# Altium project PROC051C_AWR1843BOOST_RevC.PrjPcb (part 5 of 7)

## Sheet PROC051C_HD Connector.SchDoc: HD Connector
size 431 x 279 mm; Date: Not shown in title block; ApprovedBy: Not shown in title block; CheckedBy: Not shown in title block; Author: Not shown in title block; CompanyName: Not shown in title block; Engineer: Not shown in title block; Organization: Not shown in title block; Address1: Not shown in title block; Address2: Not shown in title block; Address3: Not shown in title block; Address4: Not shown in title block; DocumentNumber: 10; Revision: Use project parameter SCH_Rev; SheetNumber: 10; SheetTotal: 16; PageSetup: Record=PageOptions|CenterHorizontal=True|CenterVertical=True|PrintScale=1.00|XCorrection=1.00|YCorrection=1.00|PrintKind=0|BorderSize=5000000|LeftOffset=0|BottomOffset=0|Orientation=2|PaperLength=1000|PaperWidth=1000|Scale=100|PaperSource=15|PrintQuality=600|MediaType=1|DitherType=10|PrintScaleMode=1|PaperKind=Letter; CurrentTime: Not shown in title block; CurrentDate: Not shown in title block; Time: Not shown in title block; DocumentFullPathAndName: Not shown in title block; DocumentName: Not shown in title block; ModifiedDate: Not shown in title block; ImagePath: Not shown in title block
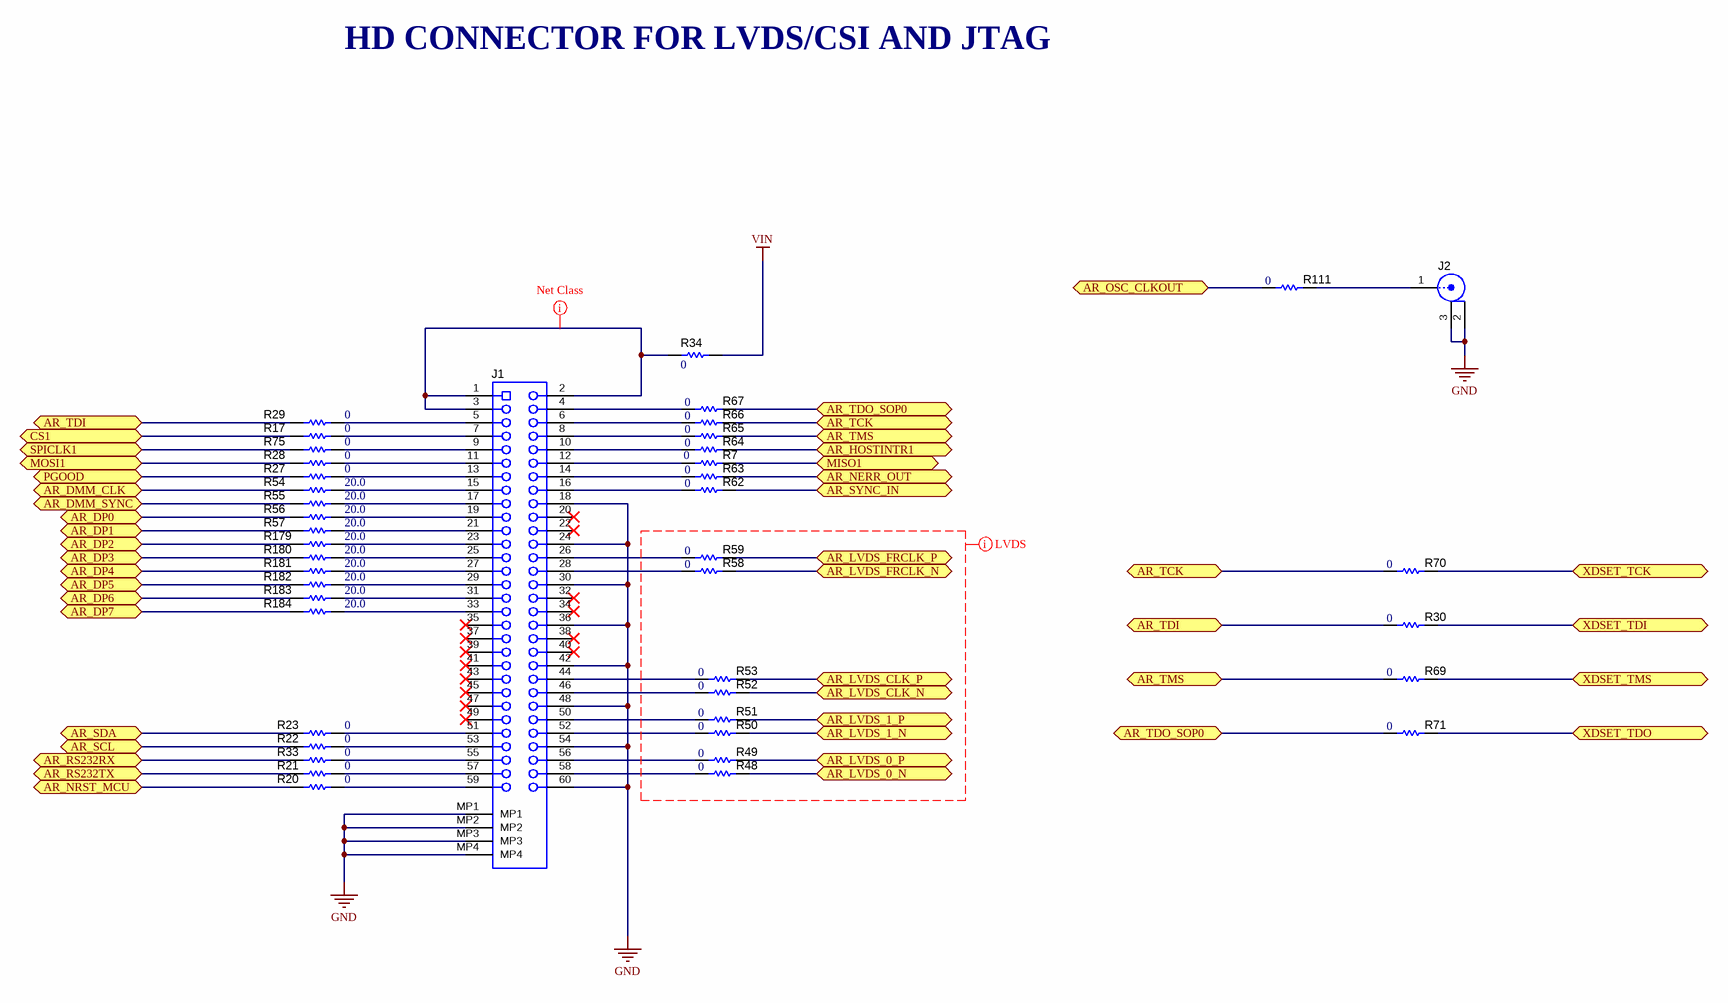
[diagram p9: PROC051C_HD Connector.SchDoc]

### Parts
J1  QSH-030-01-L-D-A  [Samtec_QSH-030-01-X-D-A]  (value not drawn)
J2  128-0711-201  [Johnson_128-0711-201]  (value not drawn)
R7  ValueDisplayed: 0  [0201_Silk]  (hidden comment: CRCW02010000Z0ED)
R17  ValueDisplayed: 0  [0201_Silk]  (hidden comment: CRCW02010000Z0ED)
R20  ValueDisplayed: 0  [0201_Silk]  (hidden comment: CRCW02010000Z0ED)
R21  ValueDisplayed: 0  [0201_Silk]  (hidden comment: CRCW02010000Z0ED)
R22  ValueDisplayed: 0  [0201_Silk]  (hidden comment: CRCW02010000Z0ED)
R23  ValueDisplayed: 0  [0201_Silk]  (hidden comment: CRCW02010000Z0ED)
R27  ValueDisplayed: 0  [0201_Silk]  (hidden comment: CRCW02010000Z0ED)
R28  ValueDisplayed: 0  [0201_Silk]  (hidden comment: CRCW02010000Z0ED)
R29  ValueDisplayed: 0  [0201_Silk]  (hidden comment: CRCW02010000Z0ED)
R30  ValueDisplayed: 0  [0201_Silk]  (hidden comment: CRCW02010000Z0ED)
R33  ValueDisplayed: 0  [0201_Silk]  (hidden comment: CRCW02010000Z0ED)
R34  ValueDisplayed: 0  [2010]  (hidden comment: CRCW20100000Z0EF)
R48  ValueDisplayed: 0  [0201_Silk]  (hidden comment: CRCW02010000Z0ED)
R49  ValueDisplayed: 0  [0201_Silk]  (hidden comment: CRCW02010000Z0ED)
R50  ValueDisplayed: 0  [0201_Silk]  (hidden comment: CRCW02010000Z0ED)
R51  ValueDisplayed: 0  [0201_Silk]  (hidden comment: CRCW02010000Z0ED)
R52  ValueDisplayed: 0  [0201_Silk]  (hidden comment: CRCW02010000Z0ED)
R53  ValueDisplayed: 0  [0201_Silk]  (hidden comment: CRCW02010000Z0ED)
R54  ValueDisplayed: 20.0  [0201_033]  (hidden comment: CRCW020120R0FNED)
R55  ValueDisplayed: 20.0  [0201_033]  (hidden comment: CRCW020120R0FNED)
R56  ValueDisplayed: 20.0  [0201_033]  (hidden comment: CRCW020120R0FNED)
R57  ValueDisplayed: 20.0  [0201_033]  (hidden comment: CRCW020120R0FNED)
R58  ValueDisplayed: 0  [0201_Silk]  (hidden comment: CRCW02010000Z0ED)
R59  ValueDisplayed: 0  [0201_Silk]  (hidden comment: CRCW02010000Z0ED)
R62  ValueDisplayed: 0  [0201_Silk]  (hidden comment: CRCW02010000Z0ED)
R63  ValueDisplayed: 0  [0201_Silk]  (hidden comment: CRCW02010000Z0ED)
R64  ValueDisplayed: 0  [0201_Silk]  (hidden comment: CRCW02010000Z0ED)
R65  ValueDisplayed: 0  [0201_Silk]  (hidden comment: CRCW02010000Z0ED)
R66  ValueDisplayed: 0  [0201_Silk]  (hidden comment: CRCW02010000Z0ED)
R67  ValueDisplayed: 0  [0201_Silk]  (hidden comment: CRCW02010000Z0ED)
R69  ValueDisplayed: 0  [0201_Silk]  (hidden comment: CRCW02010000Z0ED)
R70  ValueDisplayed: 0  [0201_Silk]  (hidden comment: CRCW02010000Z0ED)
R71  ValueDisplayed: 0  [0201_Silk]  (hidden comment: CRCW02010000Z0ED)
R75  ValueDisplayed: 0  [0201_Silk]  (hidden comment: CRCW02010000Z0ED)
R111  ValueDisplayed: 0  [0201_Silk]  (hidden comment: CRCW02010000Z0ED)
R179  ValueDisplayed: 20.0  [0201_033]  (hidden comment: CRCW020120R0FNED)
R180  ValueDisplayed: 20.0  [0201_033]  (hidden comment: CRCW020120R0FNED)
R181  ValueDisplayed: 20.0  [0201_033]  (hidden comment: CRCW020120R0FNED)
R182  ValueDisplayed: 20.0  [0201_033]  (hidden comment: CRCW020120R0FNED)
R183  ValueDisplayed: 20.0  [0201_033]  (hidden comment: CRCW020120R0FNED)
R184  ValueDisplayed: 20.0  [0201_033]  (hidden comment: CRCW020120R0FNED)

### Ports
AR_DMM_CLK, AR_DMM_SYNC, AR_DP0, AR_DP1, AR_DP2, AR_DP3, AR_DP4, AR_DP5, AR_DP6, AR_DP7, AR_HOSTINTR1, AR_LVDS_0_N, AR_LVDS_0_P, AR_LVDS_1_N, AR_LVDS_1_P, AR_LVDS_CLK_N, AR_LVDS_CLK_P, AR_LVDS_FRCLK_N, AR_LVDS_FRCLK_P, AR_NERR_OUT, AR_NRST_MCU, AR_OSC_CLKOUT, AR_RS232RX, AR_RS232TX, AR_SCL, AR_SDA, AR_SYNC_IN, AR_TCK, AR_TDI, AR_TDO_SOP0, AR_TMS, CS1, MISO1, MOSI1, PGOOD, SPICLK1, XDSET_TCK, XDSET_TDI, XDSET_TDO, XDSET_TMS

### Nets
GND: J1.18 J1.24 J1.30 J1.36 J1.42 J1.48 J1.54 J1.60 J1.MP1 J1.MP2 J1.MP3 J1.MP4 J2.2 J2.3
VIN: R34.2
AR_DMM_CLK: R54.1 ; port AR_DMM_CLK
AR_DMM_SYNC: R55.1 ; port AR_DMM_SYNC
AR_DP0: R56.1 ; port AR_DP0
AR_DP1: R57.1 ; port AR_DP1
AR_DP2: R179.1 ; port AR_DP2
AR_DP3: R180.1 ; port AR_DP3
AR_DP4: R181.1 ; port AR_DP4
AR_DP5: R182.1 ; port AR_DP5
AR_DP6: R183.1 ; port AR_DP6
AR_DP7: R184.1 ; port AR_DP7
AR_HOSTINTR1: R64.2 ; port AR_HOSTINTR1
AR_LVDS_0_N: R48.2 ; port AR_LVDS_0_N
AR_LVDS_0_P: R49.2 ; port AR_LVDS_0_P
AR_LVDS_1_N: R50.2 ; port AR_LVDS_1_N
AR_LVDS_1_P: R51.2 ; port AR_LVDS_1_P
AR_LVDS_CLK_N: R52.2 ; port AR_LVDS_CLK_N
AR_LVDS_CLK_P: R53.2 ; port AR_LVDS_CLK_P
AR_LVDS_FRCLK_N: R58.2 ; port AR_LVDS_FRCLK_N
AR_LVDS_FRCLK_P: R59.2 ; port AR_LVDS_FRCLK_P
AR_NERR_OUT: R63.2 ; port AR_NERR_OUT
AR_NRST_MCU: R20.1 ; port AR_NRST_MCU
AR_OSC_CLKOUT: R111.1 ; port AR_OSC_CLKOUT
AR_RS232RX: R33.1 ; port AR_RS232RX
AR_RS232TX: R21.1 ; port AR_RS232TX
AR_SCL: R22.1 ; port AR_SCL
AR_SDA: R23.1 ; port AR_SDA
AR_SYNC_IN: R62.2 ; port AR_SYNC_IN
AR_TCK: R66.2 R70.1 ; port AR_TCK
AR_TDI: R29.1 R30.1 ; port AR_TDI
AR_TDO_SOP0: R67.2 R71.1 ; port AR_TDO_SOP0
AR_TMS: R65.2 R69.1 ; port AR_TMS
CS1: R17.1 ; port CS1
MISO1: R7.2 ; port MISO1
MOSI1: R28.1 ; port MOSI1
PGOOD: R27.1 ; port PGOOD
SPICLK1: R75.1 ; port SPICLK1
XDSET_TCK: R70.2 ; port XDSET_TCK
XDSET_TDI: R30.2 ; port XDSET_TDI
XDSET_TDO: R71.2 ; port XDSET_TDO
XDSET_TMS: R69.2 ; port XDSET_TMS
NetJ1_1: J1.1 J1.2 J1.3 R34.1
NetJ1_4: J1.4 R67.1
NetJ1_5: J1.5 R29.2
NetJ1_6: J1.6 R66.1
NetJ1_7: J1.7 R17.2
NetJ1_8: J1.8 R65.1
NetJ1_9: J1.9 R75.2
NetJ1_10: J1.10 R64.1
NetJ1_11: J1.11 R28.2
NetJ1_12: J1.12 R7.1
NetJ1_13: J1.13 R27.2
NetJ1_14: J1.14 R63.1
NetJ1_15: J1.15 R54.2
NetJ1_16: J1.16 R62.1
NetJ1_17: J1.17 R55.2
NetJ1_19: J1.19 R56.2
NetJ1_21: J1.21 R57.2
NetJ1_23: J1.23 R179.2
NetJ1_25: J1.25 R180.2
NetJ1_26: J1.26 R59.1
NetJ1_27: J1.27 R181.2
NetJ1_28: J1.28 R58.1
NetJ1_29: J1.29 R182.2
NetJ1_31: J1.31 R183.2
NetJ1_33: J1.33 R184.2
NetJ1_44: J1.44 R53.1
NetJ1_46: J1.46 R52.1
NetJ1_50: J1.50 R51.1
NetJ1_51: J1.51 R23.2
NetJ1_52: J1.52 R50.1
NetJ1_53: J1.53 R22.2
NetJ1_55: J1.55 R33.2
NetJ1_56: J1.56 R49.1
NetJ1_57: J1.57 R21.2
NetJ1_58: J1.58 R48.1
NetJ1_59: J1.59 R20.2
NetJ2_1: J2.1 R111.2

Not connected (* = marked no-connect by the designer): J1 20* 22* 32* 34* 35* 37* 38* 39* 40* 41* 43* 45* 47* 49*

### Layout directives
net class Undefined: (no net found under the mark)
net class PWR: NetJ1_1

### Notes on the sheet
- HD CONNECTOR FOR LVDS/CSI AND JTAG
- Drawn By:
- SVN Rev:
- Number:
- TID #:
- Orderable:
- Rev:
- Sheet Title:
- File:
- Project Title:
- Designed for:
- Assembly Variant:
- Mod. Date:
- Sheet:
- Size:
- of
- B
- http://www.ti.com
- Texas Instruments and/or its licensors do not warrant the accuracy or completeness of this specification or any information contained therein. Texas Instruments and/or its licensors do not warrant that this design will meet the specifications, will be suitable for your application or fit for any particular purpose, or will operate in an implementation. Texas Instruments and/or its licensors do not warrant that the design is production worthy. You should completely validate and test your design implementation to confirm the system functionality for your application.
- Engineer:
- Contact:
- © Texas Instruments

### Library data of the parts
J1 = CMP-0075524-1: Receptacle, 0.5 mm, 30x2, Gold, TH; Manufacturer: Samtec; Pitch_mm: 0.5; Gender: Female; Green_REACh: Passed; CT: False; Shrouded: N; RowSpacing_mm: 5.73; Green_Lifecycle: Active; Row_Count: 2; ComponentLink1Description: Datasheet URL; RoHS: Y; Supplier Part Number 3: 1667876; Supplier 1: Digi-Key; Orientation: Vertical; Green_EU RoHS: Passed with Exemption; PackageReference: Receptacle, 0.5 mm, 30x2, TH; Color: Black; PartNumber: QSH-030-01-L-D-A; PinCount: 60; Publisher: Texas Instruments; Supplier Part Number 2: 19M9181; ContactFinish: Gold; Supplier 2: Newark; ComponentLink1URL: http://www.samtec.com/ftppub/cpdf/QSH-XXX-01-X-D-XX-MKT.pdf; LatestRevisionDate: 2017-07-12; CompType: Receptacle; CNHeader: False; MountType: SMT; Supplier Part Number 1: SAM8180-ND; Supplier 3: Farnell; Green_EU RoHS-2: Passed
J2 = CMP-0055788-1: UMC Straight Jack Receptacle, 50 Ohm, Gold, SMT; Manufacturer: Cinch Connectivity; CNHeader: FALSE; Gender: Female; ComponentLink1URL: https://cinchconnectivity.com/OA_MEDIA/catalog/pdf_UMCCatalogcatalog.pdf; Supplier Part Number 2: 99M0460; Publisher: Texas Instruments; Supplier 2: Newark; Supplier Part Number 3: 530-1280711201; Supplier 3: Mouser; RoHS: Y; MountType: SMT; Supplier 1: Digi-Key; PackageReference: UMC Straight Jack Receptacle, SMT; PinCount: 3; CompType: Jack; LatestRevisionDate: 26/05/2017; PartNumber: 128-0711-201; Orientation: Vertical; ComponentLink1Description: Datasheet URL; Supplier Part Number 1: J983CT-ND; ContactFinish: Gold; CT: FALSE
R7 R17 R20-R23 R27-R30 R33 R48-R53 R58 R59 R62-R67 R69-R71 R75 R111 = CMP-0027008-4: as R72 on sheet PROC051C_RST_LEDs; RoHS: E; Value1: 5%; MountType: SMT; Supplier 1: Newark; PackageReference: 0201; Tolerance_%: 5%; Res_ohm: 0; CompType: Resistor; PartNumber: CRCW02010000Z0ED; ComponentLink1Description: Datasheet link; AEC Grade: N/A; Supplier Part Number 1: 72M6743; Technology: Thick Film; ComponentLink1URL: http://www.vishay.com/docs/20052/crcw0201e3.pdf
R34 = CMP-0016044-3: RES, 0, 5%, 0.75 W, AEC-Q200 Grade 0, 2010; Manufacturer: Vishay-Dale; Power_W: 750mW; TempCo: ppm/C; Value_Code: 0000; Value: 0; EIA_Code: E24; SizeX_mm: 5; SizeY_mm: 2.5; SizeZ_mm: 1.66; Value2: 0.75W; SizeArea_mm2: 12.5; AEC Qualified: Y; AEC Category: Q200; RoHS: E; Value1: 5%; MountType: SMT; Supplier 1: Digi-Key; PackageReference: 2010; Tolerance_%: 5%; Res_ohm: 0; CompType: Resistor; PartNumber: CRCW20100000Z0EF; ComponentLink1Description: Datasheet link; AEC Grade: 0; Supplier Part Number 1: 541-0.0WCT-ND; Technology: Thick Film; ComponentLink1URL: http://www.vishay.com/docs/20035/dcrcwe3.pdf
R54-R57 R179-R184 = CMP-0078192-2: RES, 20.0, 1%, 0.05 W, 0201; Manufacturer: Vishay-Dale; Value_Code: 20R0; SizeArea_mm2: 0.18; AEC Qualified: N; AEC Category: Q200; Res_ohm: 20; Value: 20.0; SizeZ_mm: 0.33; EIA_Code: E96; TempCo: 200 ppm/C; Power_W: 50mW; VDC_V: 30V; SizeY_mm: 0.3; Value2: 0.05W; SizeX_mm: 0.6; ComponentLink1Description: Datasheet link; RoHS: E; Supplier Part Number 3: 71-CRCW020120R0FNED; Tolerance_%: 1%; Supplier 1: Digi-Key; PackageReference: 0201; Technology: Thick Film; PartNumber: CRCW020120R0FNED; Supplier Part Number 2: 87W8830; Supplier 2: Newark; AEC Grade: N/A; ComponentLink1URL: http://www.vishay.com/docs/20052/crcw0201e3.pdf; Value1: 1%; CompType: Resistor; MountType: SMT; Supplier Part Number 1: 541-2947-1-ND; Supplier 3: Mouser

## Sheet PROC051C_LP Connector.SchDoc: LP Connector
size 431 x 279 mm; Date: Not shown in title block; ApprovedBy: Not shown in title block; CheckedBy: Not shown in title block; Author: Not shown in title block; CompanyName: Not shown in title block; Engineer: Not shown in title block; Organization: Not shown in title block; Address1: Not shown in title block; Address2: Not shown in title block; Address3: Not shown in title block; Address4: Not shown in title block; DocumentNumber: 11; Revision: Use project parameter SCH_Rev; SheetNumber: 11; SheetTotal: 16; PageSetup: Record=PageOptions|CenterHorizontal=True|CenterVertical=True|PrintScale=1.00|XCorrection=1.00|YCorrection=1.00|PrintKind=0|BorderSize=5000000|LeftOffset=0|BottomOffset=0|Orientation=2|PaperLength=1000|PaperWidth=1000|Scale=100|PaperSource=15|PrintQuality=600|MediaType=1|DitherType=10|PaperKind=Letter|PrintScaleMode=1; CurrentTime: Not shown in title block; CurrentDate: Not shown in title block; Time: Not shown in title block; DocumentFullPathAndName: Not shown in title block; DocumentName: Not shown in title block; ModifiedDate: Not shown in title block; ImagePath: Not shown in title block
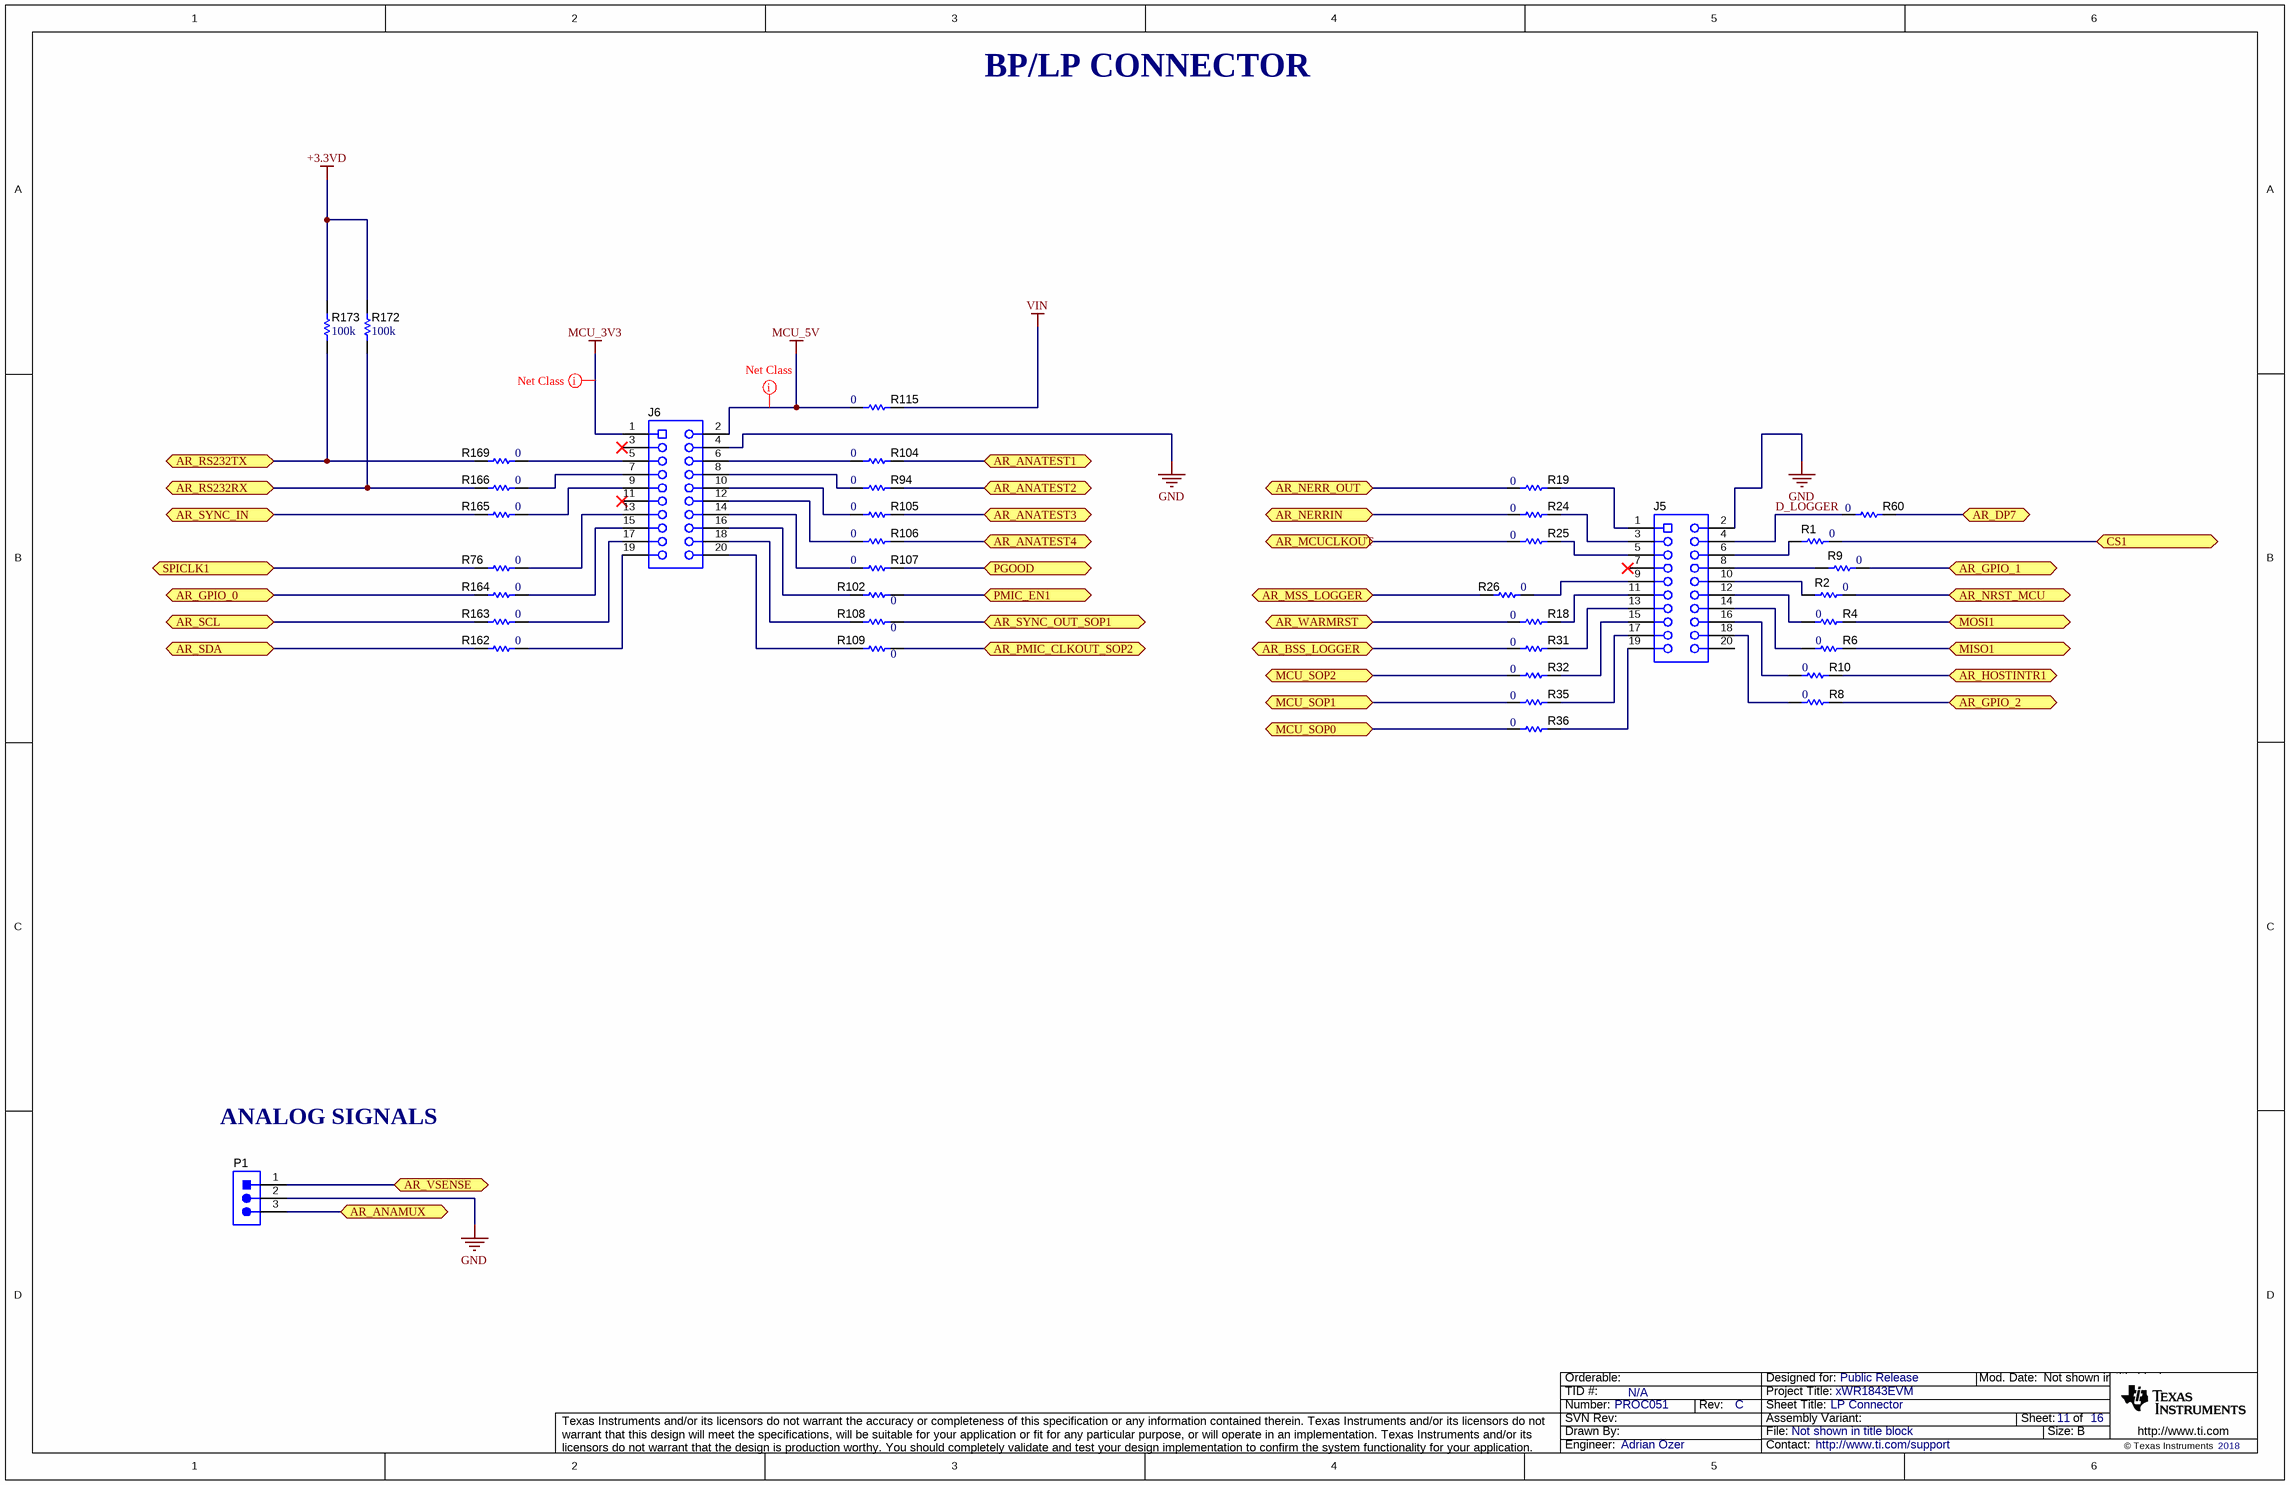
[diagram p10: PROC051C_LP Connector.SchDoc]

### Parts
J5  SSM-110-S-DV  [Samtec_SSM-110-x-DV]  (value not drawn)
J6  SSM-110-S-DV  [Samtec_SSM-110-x-DV]  (value not drawn)
P1  TSW-103-07-T-S  [Samtec_TSW-103-07-T-S]  (value not drawn)
R1  ValueDisplayed: 0  [0201_Silk]  (hidden comment: CRCW02010000Z0ED)
R2  ValueDisplayed: 0  [0201_Silk]  (hidden comment: CRCW02010000Z0ED)
R4  ValueDisplayed: 0  [0201_Silk]  (hidden comment: CRCW02010000Z0ED)
R6  ValueDisplayed: 0  [0201_Silk]  (hidden comment: CRCW02010000Z0ED)
R8  ValueDisplayed: 0  [0201_Silk]  (hidden comment: CRCW02010000Z0ED)
R9  ValueDisplayed: 0  [0201_Silk]  (hidden comment: CRCW02010000Z0ED)
R10  ValueDisplayed: 0  [0201_Silk]  (hidden comment: CRCW02010000Z0ED)
R18  ValueDisplayed: 0  [0201_Silk]  (hidden comment: CRCW02010000Z0ED)
R19  ValueDisplayed: 0  [0201_Silk]  (hidden comment: CRCW02010000Z0ED)
R24  ValueDisplayed: 0  [0201_Silk]  (hidden comment: CRCW02010000Z0ED)
R25  ValueDisplayed: 0  [0201_Silk]  (hidden comment: CRCW02010000Z0ED)
R26  ValueDisplayed: 0  [0201_Silk]  (hidden comment: CRCW02010000Z0ED)
R31  ValueDisplayed: 0  [0201_Silk]  (hidden comment: CRCW02010000Z0ED)
R32  ValueDisplayed: 0  [0201_Silk]  (hidden comment: CRCW02010000Z0ED)
R35  ValueDisplayed: 0  [0201_Silk]  (hidden comment: CRCW02010000Z0ED)
R36  ValueDisplayed: 0  [0201_Silk]  (hidden comment: CRCW02010000Z0ED)
R60  ValueDisplayed: 0  [0201_Silk]  (hidden comment: CRCW02010000Z0ED)
R76  ValueDisplayed: 0  [0201_Silk]  (hidden comment: CRCW02010000Z0ED)
R94  ValueDisplayed: 0  [0201_Silk]  (hidden comment: CRCW02010000Z0ED)
R102  ValueDisplayed: 0  [0201_Silk]  (hidden comment: CRCW02010000Z0ED)
R104  ValueDisplayed: 0  [0201_Silk]  (hidden comment: CRCW02010000Z0ED)
R105  ValueDisplayed: 0  [0201_Silk]  (hidden comment: CRCW02010000Z0ED)
R106  ValueDisplayed: 0  [0201_Silk]  (hidden comment: CRCW02010000Z0ED)
R107  ValueDisplayed: 0  [0402L]  (hidden comment: ERJ-2GE0R00X)
R108  ValueDisplayed: 0  [0201_Silk]  (hidden comment: CRCW02010000Z0ED)
R109  ValueDisplayed: 0  [0201_Silk]  (hidden comment: CRCW02010000Z0ED)
R115  ValueDisplayed: 0  [2010]  (hidden comment: CRCW20100000Z0EF)
R162  ValueDisplayed: 0  [0201_Silk]  (hidden comment: CRCW02010000Z0ED)
R163  ValueDisplayed: 0  [0201_Silk]  (hidden comment: CRCW02010000Z0ED)
R164  ValueDisplayed: 0  [0201_Silk]  (hidden comment: CRCW02010000Z0ED)
R165  ValueDisplayed: 0  [0201_Silk]  (hidden comment: CRCW02010000Z0ED)
R166  ValueDisplayed: 0  [0201_Silk]  (hidden comment: CRCW02010000Z0ED)
R169  ValueDisplayed: 0  [0201_Silk]  (hidden comment: CRCW02010000Z0ED)
R172  ValueDisplayed: 100k  [0402L]  (hidden comment: CRCW0402100KFKED)
R173  ValueDisplayed: 100k  [0402L]  (hidden comment: CRCW0402100KFKED)

### Ports
AR_ANAMUX, AR_ANATEST1, AR_ANATEST2, AR_ANATEST3, AR_ANATEST4, AR_BSS_LOGGER, AR_DP7, AR_GPIO_0, AR_GPIO_1, AR_GPIO_2, AR_HOSTINTR1, AR_MCUCLKOUT, AR_MSS_LOGGER, AR_NERR_OUT, AR_NERRIN, AR_NRST_MCU, AR_PMIC_CLKOUT_SOP2, AR_RS232RX, AR_RS232TX, AR_SCL, AR_SDA, AR_SYNC_IN, AR_SYNC_OUT_SOP1, AR_VSENSE, AR_WARMRST, CS1, MCU_SOP0, MCU_SOP1, MCU_SOP2, MISO1, MOSI1, PGOOD, PMIC_EN1, SPICLK1

### Nets
+3.3VD: R172.2 R173.2
GND: J5.2 J6.4 P1.2
MCU_3V3: J6.1
MCU_5V: J6.2 R115.1
VIN: R115.2
AR_ANAMUX: P1.3 ; port AR_ANAMUX
AR_ANATEST1: R104.2 ; port AR_ANATEST1
AR_ANATEST2: R94.2 ; port AR_ANATEST2
AR_ANATEST3: R105.2 ; port AR_ANATEST3
AR_ANATEST4: R106.2 ; port AR_ANATEST4
AR_BSS_LOGGER: R31.1 ; port AR_BSS_LOGGER
AR_DP7: R60.2 ; port AR_DP7
AR_GPIO_0: R164.1 ; port AR_GPIO_0
AR_GPIO_1: R9.2 ; port AR_GPIO_1
AR_GPIO_2: R8.2 ; port AR_GPIO_2
AR_HOSTINTR1: R10.2 ; port AR_HOSTINTR1
AR_MCUCLKOUT: R25.1 ; port AR_MCUCLKOUT
AR_MSS_LOGGER: R26.1 ; port AR_MSS_LOGGER
AR_NERR_OUT: R19.1 ; port AR_NERR_OUT
AR_NERRIN: R24.1 ; port AR_NERRIN
AR_NRST_MCU: R2.2 ; port AR_NRST_MCU
AR_PMIC_CLKOUT_SOP2: R109.2 ; port AR_PMIC_CLKOUT_SOP2
AR_RS232RX: R166.1 R172.1 ; port AR_RS232RX
AR_RS232TX: R169.1 R173.1 ; port AR_RS232TX
AR_SCL: R163.1 ; port AR_SCL
AR_SDA: R162.1 ; port AR_SDA
AR_SYNC_IN: R165.1 ; port AR_SYNC_IN
AR_SYNC_OUT_SOP1: R108.2 ; port AR_SYNC_OUT_SOP1
AR_VSENSE: P1.1 ; port AR_VSENSE
AR_WARMRST: R18.1 ; port AR_WARMRST
CS1: R1.2 ; port CS1
D_LOGGER: J5.4 R60.1
MCU_SOP0: R36.1 ; port MCU_SOP0
MCU_SOP1: R35.1 ; port MCU_SOP1
MCU_SOP2: R32.1 ; port MCU_SOP2
MISO1: R6.2 ; port MISO1
MOSI1: R4.2 ; port MOSI1
PGOOD: R107.2 ; port PGOOD
PMIC_EN1: R102.2 ; port PMIC_EN1
SPICLK1: R76.1 ; port SPICLK1
NetJ5_1: J5.1 R19.2
NetJ5_3: J5.3 R24.2
NetJ5_5: J5.5 R25.2
NetJ5_6: J5.6 R1.1
NetJ5_8: J5.8 R9.1
NetJ5_9: J5.9 R26.2
NetJ5_10: J5.10 R2.1
NetJ5_11: J5.11 R18.2
NetJ5_12: J5.12 R4.1
NetJ5_13: J5.13 R31.2
NetJ5_14: J5.14 R6.1
NetJ5_15: J5.15 R32.2
NetJ5_16: J5.16 R10.1
NetJ5_17: J5.17 R35.2
NetJ5_18: J5.18 R8.1
NetJ5_19: J5.19 R36.2
NetJ6_5: J6.5 R169.2
NetJ6_6: J6.6 R104.1
NetJ6_7: J6.7 R166.2
NetJ6_8: J6.8 R94.1
NetJ6_9: J6.9 R165.2
NetJ6_10: J6.10 R105.1
NetJ6_12: J6.12 R106.1
NetJ6_13: J6.13 R76.2
NetJ6_14: J6.14 R107.1
NetJ6_15: J6.15 R164.2
NetJ6_16: J6.16 R102.1
NetJ6_17: J6.17 R163.2
NetJ6_18: J6.18 R108.1
NetJ6_19: J6.19 R162.2
NetJ6_20: J6.20 R109.1

Not connected (* = marked no-connect by the designer): J5 7* 20; J6 3* 11*

### Layout directives
net class PWR: MCU_3V3, MCU_5V

### Notes on the sheet
- BP/LP CONNECTOR
- ANALOG SIGNALS
- Drawn By:
- SVN Rev:
- Number:
- TID #:
- Orderable:
- Rev:
- Sheet Title:
- File:
- Project Title:
- Designed for:
- Assembly Variant:
- Mod. Date:
- Sheet:
- Size:
- of
- B
- http://www.ti.com
- Texas Instruments and/or its licensors do not warrant the accuracy or completeness of this specification or any information contained therein. Texas Instruments and/or its licensors do not warrant that this design will meet the specifications, will be suitable for your application or fit for any particular purpose, or will operate in an implementation. Texas Instruments and/or its licensors do not warrant that the design is production worthy. You should completely validate and test your design implementation to confirm the system functionality for your application.
- Engineer:
- Contact:
- © Texas Instruments

### Library data of the parts
J5 J6 = CMP-0078182-1: Receptacle, 2.54mm, 10x2, Gold with Tin tail, SMT; Manufacturer: Samtec; Pitch_mm: 2.54; Gender: Female; Cert_CSA: Y; Voltage_V: 405V; Current_A: 5.2A; Row_Count: 2; CompType: Socket Strip; ComponentLink1Description: Datasheet URL; RoHS: Y; Supplier 1: Digi-Key; Cert_UL: Y; Orientation: Vertical; PackageReference: Receptacle, 2.54mm, 10x2, SMT; Color: Black; PartNumber: SSM-110-S-DV; PinCount: 20; Supplier Part Number 2: 66H7361; ContactFinish: Gold; Supplier 2: Newark; RowSpacing_mm: 2.54; ComponentLink1URL: http://suddendocs.samtec.com/catalog_english/ssm_sm.pdf; MountType: SMT; Supplier Part Number 1: SAM1150-10-ND
P1 = CMP-0075530-2: Header, 2.54 mm, 3x1, Tin, TH; Manufacturer: Samtec; Pitch_mm: 2.54; Cert_VDE: N; Gender: Male; Cert_CSA: Y; Voltage_V: 550V; Green_REACh: Passed; Current_A: 6.3A; Green_Lifecycle: Active; Row_Count: 1; ComponentLink1Description: Datasheet URL; RoHS: Y; Supplier Part Number 3: 2035682; Supplier 1: Digi-Key; Cert_UL: Y; Orientation: Vertical; Green_EU RoHS: Passed; PackageReference: Header, 2.54 mm, 3x1, TH; Color: Black; PartNumber: TSW-103-07-T-S; PinCount: 3; Supplier Part Number 2: 12P1325; ContactFinish: Tin; Supplier 2: Newark; Cert_CULUS: N; Shrouded: N; ClassName: Header; ComponentLink1URL: http://www.samtec.com/ftppub/cpdf/TSW-XXX-XX-XXX-X-XX-XXX-MKT.pdf; CompType: Header; MountType: TH; Supplier Part Number 1: SAM1035-03-ND; Supplier 3: Farnell; Green_EU RoHS-2: Passed
R1 R2 R4 R6 R8-R10 R18 R19 R24-R26 R31 R32 R35 R36 R60 R76 R94 R102 R104-R106 R108 R109 R162-R166 R169 = CMP-0027008-4: as R72 on sheet PROC051C_RST_LEDs; RoHS: E; Value1: 5%; MountType: SMT; Supplier 1: Newark; PackageReference: 0201; Tolerance_%: 5%; Res_ohm: 0; CompType: Resistor; PartNumber: CRCW02010000Z0ED; ComponentLink1Description: Datasheet link; AEC Grade: N/A; Supplier Part Number 1: 72M6743; Technology: Thick Film; ComponentLink1URL: http://www.vishay.com/docs/20052/crcw0201e3.pdf
R107 = CMP-0026992-3: as R37 on sheet PROC051C_QSPI_Flash_Reference; Supplier Part Number 2: 65T8307; Supplier 2: Newark; Supplier Part Number 3: 667-ERJ-2GE0R00X; Supplier 3: Mouser; RoHS: Y; Value1: 5%; MountType: SMT; Supplier 1: Digi-Key; PackageReference: 0402; Tolerance_%: 5%; Res_ohm: 0; SizeArea_mm2: 0.5; CompType: Resistor; PartNumber: ERJ-2GE0R00X; ComponentLink1Description: Datasheet link; Supplier Part Number 1: P0.0JCT-ND; Technology: Thick Film; ComponentLink1URL: https://industrial.panasonic.com/cdbs/www-data/pdf/RDA0000/AOA0000C301.pdf; AEC Grade: 0
R115 = CMP-0016044-3: as R34 on sheet PROC051C_HD Connector; RoHS: E; Value1: 5%; MountType: SMT; Supplier 1: Digi-Key; PackageReference: 2010; Tolerance_%: 5%; Res_ohm: 0; CompType: Resistor; PartNumber: CRCW20100000Z0EF; ComponentLink1Description: Datasheet link; AEC Grade: 0; Supplier Part Number 1: 541-0.0WCT-ND; Technology: Thick Film; ComponentLink1URL: http://www.vishay.com/docs/20035/dcrcwe3.pdf
R172 R173 = CMP-0025950-3: as R110 on sheet PROC051C_RST_LEDs; Supplier Part Number 2: 52K6607; Supplier 2: Newark; Supplier Part Number 3: 71-CRCW0402-100K-E3; Supplier 3: Mouser; Value_Code: 100k; RoHS: E; Value1: 1%; MountType: SMT; Supplier 1: Digi-Key; PackageReference: 0402; Tolerance_%: 1%; Res_ohm: 100k; SizeArea_mm2: 0.5; CompType: Resistor; PartNumber: CRCW0402100KFKED; ComponentLink1Description: Datasheet link; Supplier Part Number 1: 541-100KLCT-ND; Technology: Thick Film; ComponentLink1URL: http://www.vishay.com/docs/20035/dcrcwe3.pdf

## Sheet PROC051C_XDS110 Interface_1A.SchDoc: XDS110 Interface_1A
size 431 x 279 mm; Date: Not shown in title block; ApprovedBy: Not shown in title block; CheckedBy: Not shown in title block; Author: Not shown in title block; CompanyName: Not shown in title block; Engineer: Not shown in title block; Organization: Not shown in title block; Address1: Not shown in title block; Address2: Not shown in title block; Address3: Not shown in title block; Address4: Not shown in title block; DocumentNumber: 12; Revision: Use project parameter SCH_Rev; SheetNumber: 12; SheetTotal: 16; PageSetup: Record=PageOptions|CenterHorizontal=True|CenterVertical=True|PrintScale=1.00|XCorrection=1.00|YCorrection=1.00|PrintKind=0|BorderSize=5000000|LeftOffset=0|BottomOffset=0|Orientation=2|PaperLength=1000|PaperWidth=1000|Scale=100|PaperSource=15|PrintQuality=600|MediaType=1|DitherType=10|PaperKind=Letter|PrintScaleMode=1; CurrentTime: Not shown in title block; CurrentDate: Not shown in title block; Time: Not shown in title block; DocumentFullPathAndName: Not shown in title block; DocumentName: Not shown in title block; ModifiedDate: Not shown in title block; ImagePath: Not shown in title block
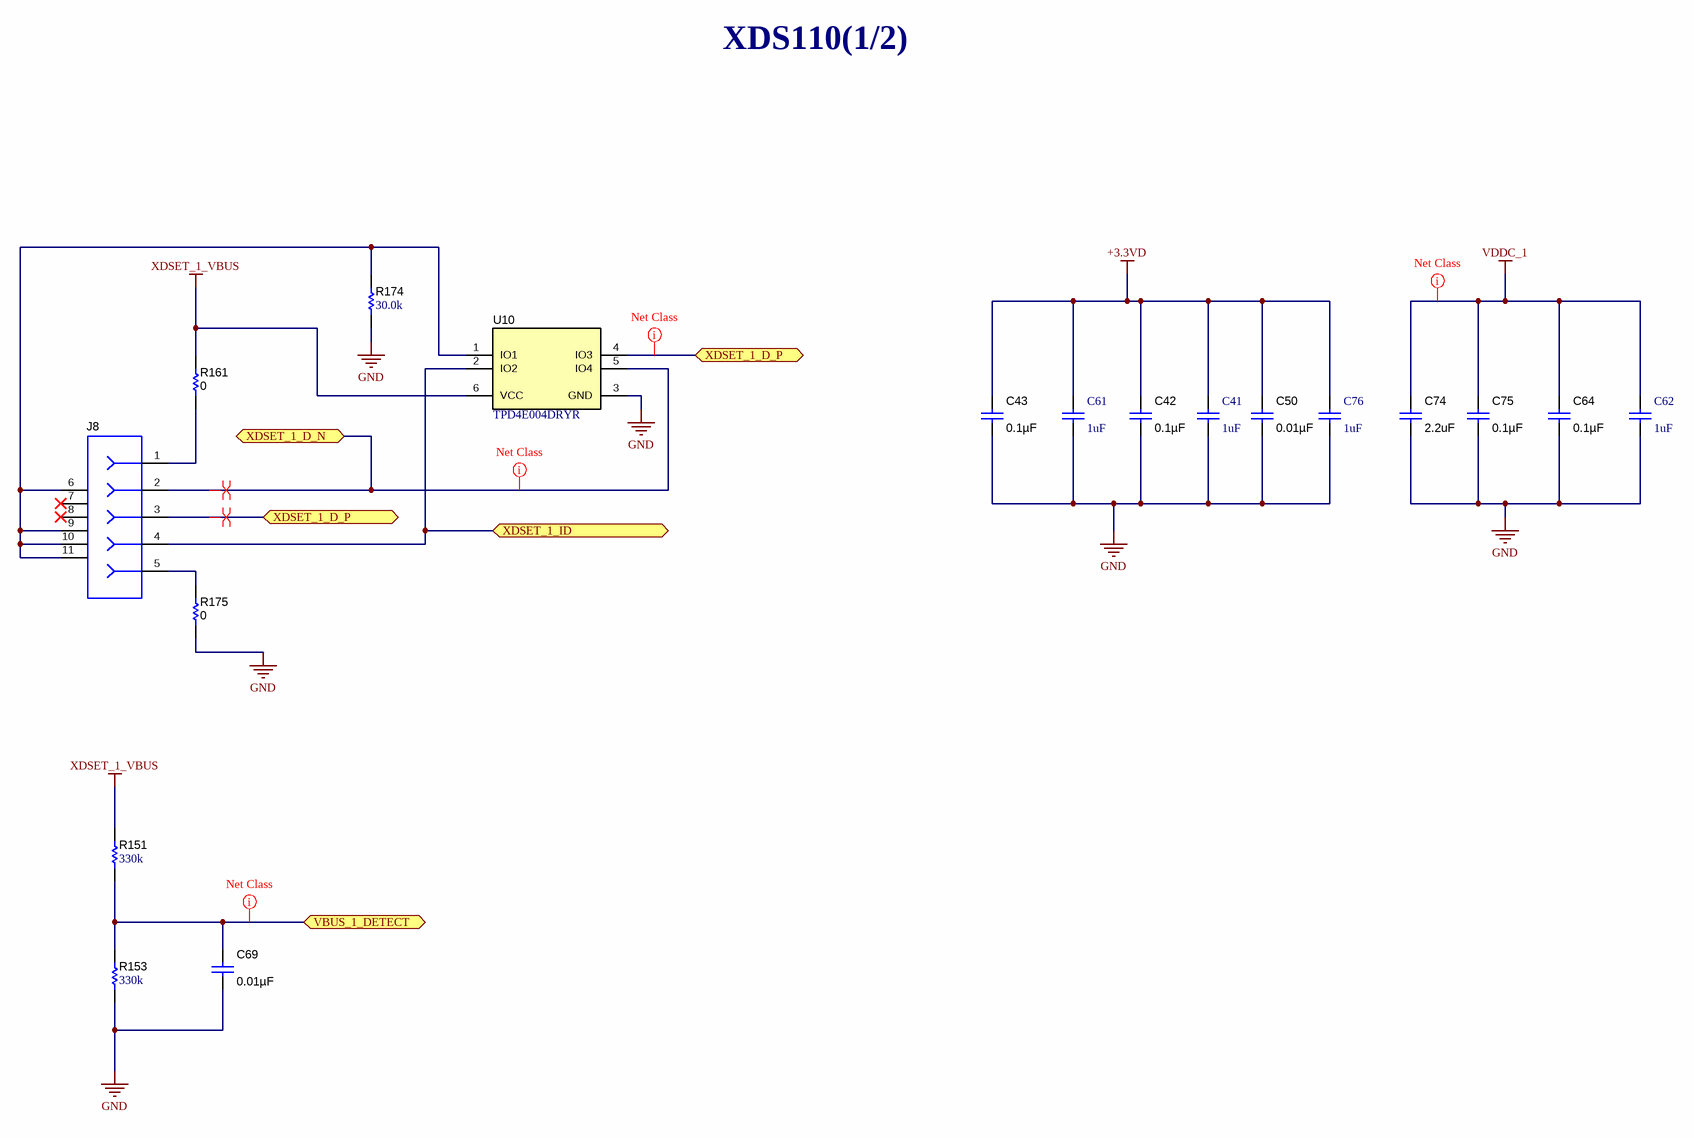
[diagram p11: PROC051C_XDS110 Interface_1A.SchDoc]

### Parts
C41  ValueDisplayed: 1uF  [0402_070]  (hidden comment: GCM155C71A105KE38D)
C42  ValueDisplayed: 0.1µF  [0402L]  (hidden comment: C0402C104K8RACTU)
C43  ValueDisplayed: 0.1µF  [0402L]  (hidden comment: C0402C104K8RACTU)
C50  ValueDisplayed: 0.01µF  [0402L]  (hidden comment: C0402C103K4RACTU)
C61  ValueDisplayed: 1uF  [0402_070]  (hidden comment: GCM155C71A105KE38D)
C62  ValueDisplayed: 1uF  [0402_070]  (hidden comment: GCM155C71A105KE38D)
C64  ValueDisplayed: 0.1µF  [0402L]  (hidden comment: C0402C104K8RACTU)
C69  ValueDisplayed: 0.01µF  [0402L]  (hidden comment: C0402C103K4RACTU)
C74  ValueDisplayed: 2.2uF  [0402_065L]  (hidden comment: C1005X7S1A225K050BC)
C75  ValueDisplayed: 0.1µF  [0402L]  (hidden comment: C0402C104K8RACTU)
C76  ValueDisplayed: 1uF  [0402_070]  (hidden comment: GCM155C71A105KE38D)
J8  105017-0001  [CONN_105017-0001]  (value not drawn)
R151  ValueDisplayed: 330k  [0402L]  (hidden comment: CRCW0402330KFKED)
R153  ValueDisplayed: 330k  [0402L]  (hidden comment: CRCW0402330KFKED)
R161  ValueDisplayed: 0  [0603]  (hidden comment: MCT06030Z0000ZP500)
R174  ValueDisplayed: 30.0k  [0402L]  (hidden comment: CRCW040230K0FKED)
R175  ValueDisplayed: 0  [0603]  (hidden comment: MCT06030Z0000ZP500)
U10  TPD4E004DRYR  [DRY0006A]

### Ports
VBUS_1_DETECT, XDSET_1_D_N, XDSET_1_D_P, XDSET_1_ID

### Nets
+3.3VD: C41.1 C42.2 C43.2 C50.2 C61.1 C76.1
GND: C41.2 C42.1 C43.1 C50.1 C61.2 C62.2 C64.1 C69.1 C74.1 C75.1 C76.2 R153.1 R174.1 R175.1 U10.3(GND)
VDDC_1: C62.1 C64.2 C74.2 C75.2
XDSET_1_VBUS: R151.2 R161.2 U10.6(VCC)
VBUS_1_DETECT: C69.2 R151.1 R153.2 ; port VBUS_1_DETECT
XDSET_1_D_N: J8.2 U10.5(IO4) ; port XDSET_1_D_N
XDSET_1_D_P: J8.3 U10.4(IO3) ; port XDSET_1_D_P
XDSET_1_ID: J8.4 U10.2(IO2) ; port XDSET_1_ID
NetJ8_1: J8.1 R161.1
NetJ8_5: J8.5 R175.2
NetJ8_6: J8.6 J8.9 J8.10 J8.11 R174.2 U10.1(IO1)

Not connected (* = marked no-connect by the designer): J8 7* 8*

### Layout directives
net class PWR: VBUS_1_DETECT, VDDC_1
net class USB: XDSET_1_D_N, XDSET_1_D_P
differential pair: XDSET_1_D_N, XDSET_1_D_P

### Notes on the sheet
- XDS110(1/2)
- Drawn By:
- SVN Rev:
- Number:
- TID #:
- Orderable:
- Rev:
- Sheet Title:
- File:
- Project Title:
- Designed for:
- Assembly Variant:
- Mod. Date:
- Sheet:
- Size:
- of
- B
- http://www.ti.com
- Texas Instruments and/or its licensors do not warrant the accuracy or completeness of this specification or any information contained therein. Texas Instruments and/or its licensors do not warrant that this design will meet the specifications, will be suitable for your application or fit for any particular purpose, or will operate in an implementation. Texas Instruments and/or its licensors do not warrant that the design is production worthy. You should completely validate and test your design implementation to confirm the system functionality for your application.
- Engineer:
- Contact:
- © Texas Instruments

### Library data of the parts
C41 C61 C62 C76 = CMP-0006349-2: CAP, CERM, 1 uF, 10 V, +/- 10%, X7S, AEC-Q200 Grade 1, 0402; Manufacturer: MuRata; TaMin_C: -55°C; Polarized: N; SizeAreaWB_mm2: 3; Value1: Unknown; U/M: EA; Value: 1uF; TaMax_C: 125°C; SizeZ_mm: 0.7; SizeX_mm: 1; SizeY_mm: 0.5; Cap_Case: 0402; Value2: 10V; CompType: Capacitor; AEC Qualified: Y; Cap_F: 1µF; AEC Category: Q200; Publisher: Texas Instruments; TempCo: X7S; Published: 2008-06-19; RoHS: Y; MountType: SMT; Supplier 1: Mouser; PackageReference: 0402; Tolerance_%: 10%; SizeArea_mm2: 0.5; LatestRevisionDate: 2017-03-09; PartNumber: GCM155C71A105KE38D; VDC_V: 10V; ComponentLink1Description: Datasheet link; AEC Grade: 1; Supplier Part Number 1: 81-GCM155C71A105KE8D; Technology: Ceramic; ComponentLink1URL: http://psearch.en.murata.com/capacitor/product/GCM155C71A105KE38%23.pdf
C42 C43 C64 C75 = CMP-0078241-1: CAP, CERM, 0.1 µF, 10 V,+/- 10%, X7R, 0402; Manufacturer: Kemet; TaMin_C: -55°C; Polarized: N; SizeAreaWB_mm2: 3; U/M: EA; Value: 0.1uF; TaMax_C: 125°C; SizeZ_mm: 0.6; SizeX_mm: 1; SizeY_mm: 0.5; Cap_Case: 0402; Value2: 10V; Cap_F: 100nF; AEC Category: Q200; ComponentLink1URL: https://content.kemet.com/datasheets/KEM_C1002_X7R_SMD.pdf; Supplier Part Number 2: 68X2393; Supplier 2: Newark; Supplier Part Number 3: 80-C0402C104K8R; TempCo: X7R; Supplier 3: Mouser; RoHS: Y; MountType: SMT; Supplier 1: Digi-Key; PackageReference: 0402; Tolerance_%: 10%; SizeArea_mm2: 0.5; CompType: Capacitor; PartNumber: C0402C104K8RACTU; AEC Qualified: N; VDC_V: 10V; ComponentLink1Description: Datasheet link; AEC Grade: N/A; Supplier Part Number 1: 399-3520-1-ND; Technology: Ceramic
C50 C69 = CMP-0078218-1: CAP, CERM, 0.01 µF, 16 V,+/- 10%, X7R, 0402; Manufacturer: Kemet; TaMin_C: -55°C; Polarized: N; Green_Lifecycle: Active; SizeAreaWB_mm2: 3; Green_REACh: Passed; U/M: EA; Value: 0.01uF; TaMax_C: 125°C; SizeZ_mm: 0.6; SizeX_mm: 1; SizeY_mm: 0.5; Cap_Case: 0402; Value2: 16V; Cap_F: 10nF; AEC Category: Q200; ComponentLink1URL: https://content.kemet.com/datasheets/KEM_C1002_X7R_SMD.pdf; Supplier Part Number 2: 66W8706; Supplier 2: Newark; Supplier Part Number 3: 80-C0402C103K4R; TempCo: X7R; Supplier 3: Mouser; RoHS: Y; MountType: SMT; Green_EU RoHS-2: Passed; Supplier 1: Digi-Key; Green_EU RoHS: Passed; PackageReference: 0402; Tolerance_%: 10%; SizeArea_mm2: 0.5; CompType: Capacitor; PartNumber: C0402C103K4RACTU; AEC Qualified: N; VDC_V: 16V; ComponentLink1Description: Datasheet link; AEC Grade: N/A; Supplier Part Number 1: 399-1038-1-ND; Technology: Ceramic
C74 = CMP-0006302-2: as C86 on sheet PROC051C_VPP_Supply; Supplier Part Number 2: 810-C1005X7S1A225K; Publisher: Texas Instruments; Supplier 2: Mouser; TempCo: X7S; Published: 2008-06-19; RoHS: Y; MountType: SMT; Supplier 1: Digi-Key; PackageReference: 0402; Tolerance_%: 10%; SizeArea_mm2: 0.5; LatestRevisionDate: 2017-03-09; PartNumber: C1005X7S1A225K050BC; AEC Qualified: N; VDC_V: 10V; ComponentLink1Description: Datasheet link; AEC Grade: N/A; Supplier Part Number 1: 445-9097-1-ND; Technology: Ceramic; ComponentLink1URL: https://product.tdk.com/en/search/capacitor/ceramic/mlcc/info?part_no=C1005X7S1A225K050BC
J8 = CMP-0055293-1: Connector, Receptacle, Micro-USB Type B, R/A, Bottom Mount SMT; Manufacturer: Molex; CNHeader: FALSE; Green_Lifecycle: Active; Gender: Female; Green_REACh: Passed; CompType: USB; CT: TRUE; ComponentLink1URL: http://www.molex.com/pdm_docs/sd/1050170001_sd.pdf; Supplier Part Number 2: 78R1699; Publisher: Texas Instruments; Supplier 2: Newark; Supplier Part Number 3: 538-105017-0001; Supplier 3: Mouser; RoHS: Y; MountType: SMT; Green_EU RoHS-2: Passed; Supplier 1: Digi-Key; Green_EU RoHS: Passed; PackageReference: Micro USB receptacle; LatestRevisionDate: 26/05/2017; PartNumber: 105017-0001; ComponentLink1Description: Datasheet URL; Supplier Part Number 1: WM1399CT-ND
R151 R153 = CMP-0078210-2: RES, 330 k, 1%, 0.063 W, AEC-Q200 Grade 0, 0402; Manufacturer: Vishay-Dale; SizeArea_mm2: 0.5; AEC Qualified: Y; AEC Category: Q200; Value: 330k; SizeZ_mm: 0.6; TempCo: 100 ppm/C; AEC Grade: 0; Power_W: 63mW; VDC_V: 50V; Value2: 0.063W; SizeX_mm: 1; ComponentLink1Description: Datasheet link; RoHS: E; Supplier Part Number 3: 71-CRCW0402-330K-E3; Tolerance_%: 1%; Value_Code: 330k; Supplier 1: Digi-Key; PackageReference: 0402; Technology: Thick Film; Res_ohm: 330k; PartNumber: CRCW0402330KFKED; Supplier Part Number 2: 72M6783; Supplier 2: Newark; SizeY_mm: 0.5; ComponentLink1URL: http://www.vishay.com/docs/20035/dcrcwe3.pdf; Value1: 1%; CompType: Resistor; MountType: SMT; Supplier Part Number 1: 541-330KLCT-ND; Supplier 3: Mouser
R161 R175 = CMP-0025884-3: as R133 on sheet PROC051C_RST_LEDs; Supplier Part Number 2: 96Y9454; Publisher: Texas Instruments; Supplier 2: Newark; Supplier Part Number 3: 594-MCT06030Z0000ZP5; Supplier 3: Mouser; Published: 2008-06-26; RoHS: Y; Value1: 5%; MountType: SMT; Supplier 1: Digi-Key; PackageReference: 0603; Tolerance_%: 5%; Res_ohm: 0; CompType: Resistor; LatestRevisionDate: 2017-03-09; PartNumber: MCT06030Z0000ZP500; ComponentLink1Description: Datasheet link; AEC Grade: N/A; Supplier Part Number 1: MCT0603-0.0-ZZCT-ND; Technology: Thin Film; ComponentLink1URL: http://www.vishay.com/docs/28705/mcx0x0xpro.pdf
R174 = CMP-0078244-2: RES, 30.0 k, 1%, 0.063 W, AEC-Q200 Grade 0, 0402; Manufacturer: Vishay-Dale; Power_W: 63mW; Green_Lifecycle: Active; TempCo: 100 ppm/C; Value_Code: 30k0; Green_REACh: Passed; Value: 30.0k; Res_ohm: 30k; SizeX_mm: 1; SizeY_mm: 0.5; SizeZ_mm: 0.6; Value2: 0.063W; AEC Qualified: Y; VDC_V: 50V; AEC Grade: 0; AEC Category: Q200; ComponentLink1URL: http://www.vishay.com/docs/20035/dcrcwe3.pdf; Supplier Part Number 2: 52K6953; Supplier 2: Newark; Supplier Part Number 3: 71-CRCW0402-30K-E3; Supplier 3: Mouser; RoHS: E; Value1: 1%; MountType: SMT; Green_EU RoHS-2: Passed; Supplier 1: Digi-Key; Green_EU RoHS: Passed with Exemption; PackageReference: 0402; Tolerance_%: 1%; SizeArea_mm2: 0.5; CompType: Resistor; PartNumber: CRCW040230K0FKED; ComponentLink1Description: Datasheet link; Supplier Part Number 1: 541-30.0KLCT-ND; Technology: Thick Film
U10 = CMP-0043115-3: 4-Channel ESD Protection Array for High-Speed Data Interfaces, DRY0006A (USON-6); Manufacturer: Texas Instruments; IO Leakage Current(nA): 1; USB High Speed: TRUE; IO Capacitance(Typ)(pF): 1.6; Eco-Plan: Green (RoHS & no Sb/Br); IEC 61000-4-2 Contact(+/- kV): 8; Breakdown Voltage(Min)(V): 6; IEC 61000-4-2 Air-Gap(+/- kV): 12; AEC Category: Q200; AEC Qualified: N; CompType: IC; SizeArea_mm2: 1.45; SizeAreaWB_mm2: 4.9; SizeX_mm: 1.0; SizeZ_mm: 0.6; Rating: Catalog; ComponentLink3URL: http://www.ti.com/product/tpd4e004/datasheet; ComponentLink1Description: Datasheet Link; ComponentLink2URL: http://www.ti.com/product/tpd4e004; ComponentLink1URL: http://www.ti.com/lit/ds/symlink/tpd4e004.pdf; PackageDescription: USON-6; 1394 / Firewire: TRUE; PackageReference: DRY0006A; ComponentLink3Description: Online Datasheet; ComponentLink2Description: Product Folder; Serial ATA / eSATA: TRUE; PartNumber: TPD4E004DRYR; MountType: SMT; RoHS: Y; SizeY_mm: 1.45; Operating Temperature Range: -40 to 85 C